# Altium schematic sheet DAC.SchDoc: Projekt DAC AUPSC 2019
size A4; Date: 4.10.2019; Author: Michał Grzegorzek; Organization: AGH; SheetNumber: 2; SheetTotal: 4; PageSetup: Record=PageOptions|CenterHorizontal=True|CenterVertical=True|PrintScale=0.52|XCorrection=1.00|YCorrection=1.00|PrintKind=1|BorderSize=5000000|LeftOffset=0|BottomOffset=0|Orientation=2|PaperLength=4200|PaperWidth=2970|Scale=100|PaperSource=7|PrintQuality=600|MediaType=1|DitherType=10|PaperKind=A3|PrintScaleMode=1
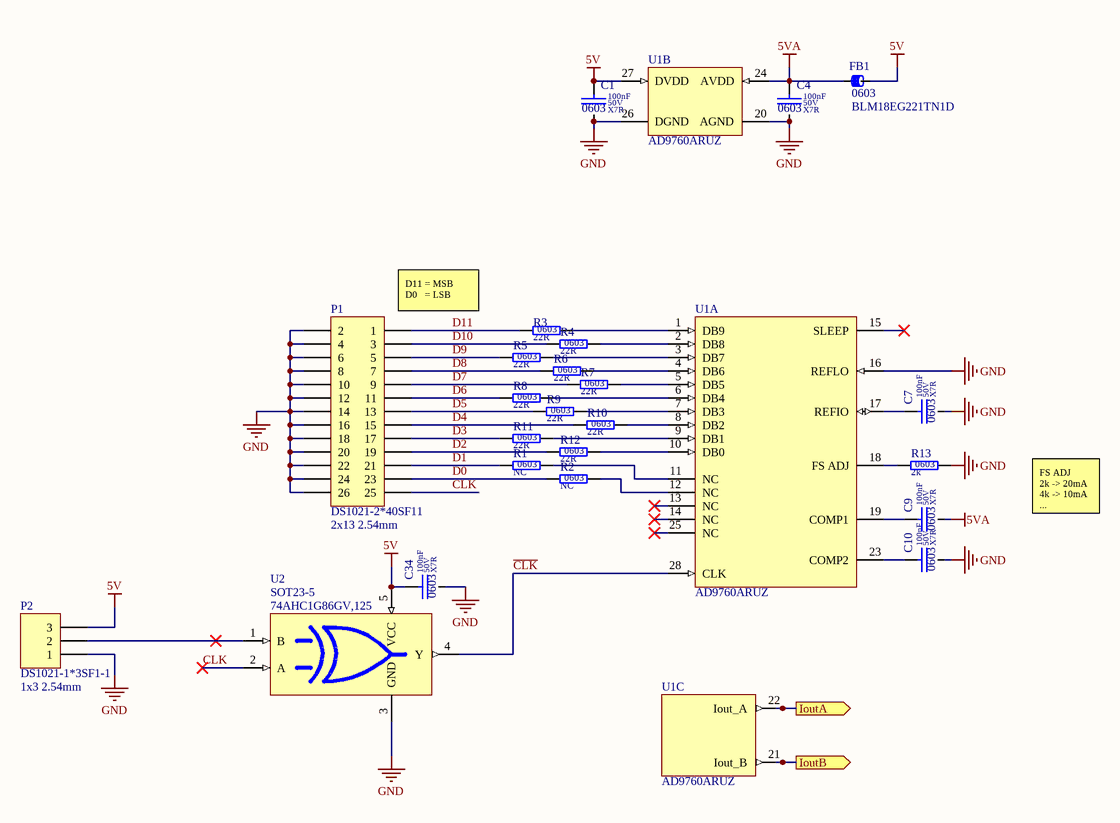
[diagram p0: DAC.SchDoc]

## Parts
C1  value 100nF  Dielectric: X7R  Voltage: 50V  SCH_Footprint: 0603  [C_0603_1608]  (hidden comment: Ceramic X7R)
C4  value 100nF  Dielectric: X7R  Voltage: 50V  SCH_Footprint: 0603  [C_0603_1608]  (hidden comment: Ceramic X7R)
C7  value 100nF  Dielectric: X7R  Voltage: 50V  SCH_Footprint: 0603  [C_0603_1608]  (hidden comment: Ceramic X7R)
C9  value 100nF  Dielectric: X7R  Voltage: 50V  SCH_Footprint: 0603  [C_0603_1608]  (hidden comment: Ceramic X7R)
C10  value 100nF  Dielectric: X7R  Voltage: 50V  SCH_Footprint: 0603  [C_0603_1608]  (hidden comment: Ceramic X7R)
C34  value 100nF  Dielectric: X7R  Voltage: 50V  SCH_Footprint: 0603  [C_0603_1608]  (hidden comment: Ceramic X7R)
FB1  value BLM18EG221TN1D  SCH_Footprint: 0603  [FB_0603_1608]  (hidden comment: Ferrite bead)
P1  value DS1021-2*40SF11  SCH_Footprint: 2x13 2.54mm  [P_HEADER_2x13_2.54]  (hidden comment: Goldpin)
P2  value DS1021-1*3SF1-1  SCH_Footprint: 1x3 2.54mm  [P_HEADER_1x3_2.54]  (hidden comment: Goldpin)
R1  value NC  SCH_Footprint: 0603  [R_NC_0603_1608]  (hidden comment: Resistor)
R2  value NC  SCH_Footprint: 0603  [R_NC_0603_1608]  (hidden comment: Resistor)
R3  value 22R  SCH_Footprint: 0603  [R_0603_1608]  (hidden comment: Resistor)
R4  value 22R  SCH_Footprint: 0603  [R_0603_1608]  (hidden comment: Resistor)
R5  value 22R  SCH_Footprint: 0603  [R_0603_1608]  (hidden comment: Resistor)
R6  value 22R  SCH_Footprint: 0603  [R_0603_1608]  (hidden comment: Resistor)
R7  value 22R  SCH_Footprint: 0603  [R_0603_1608]  (hidden comment: Resistor)
R8  value 22R  SCH_Footprint: 0603  [R_0603_1608]  (hidden comment: Resistor)
R9  value 22R  SCH_Footprint: 0603  [R_0603_1608]  (hidden comment: Resistor)
R10  value 22R  SCH_Footprint: 0603  [R_0603_1608]  (hidden comment: Resistor)
R11  value 22R  SCH_Footprint: 0603  [R_0603_1608]  (hidden comment: Resistor)
R12  value 22R  SCH_Footprint: 0603  [R_0603_1608]  (hidden comment: Resistor)
R13  value 2k  SCH_Footprint: 0603  [R_0603_1608]  (hidden comment: Resistor)
U1  value AD9760ARUZ  [TSSOP28_EP_4X10X12]  (hidden comment: 10-Bit, 125MSPS D/A Converter)  (parts A,B,C of 3)
U2  value 74AHC1G86GV,125  SCH_Footprint: SOT23-5  [SOT23-5_SC74A_SOT753_M]  (hidden comment: 2-input EXCLUSIVE-OR gate)

## Ports
IoutA (out), IoutB (out)

## Nets
5V: C1.1 C34.1 FB1.2 P2.3 U1.27(DVDD) U2.5(VCC)
5VA: C4.1 C9.2 FB1.1 U1.24(AVDD)
GND: C1.2 C4.2 C7.2 C10.2 C34.2 P1.2 P1.4 P1.6 P1.8 P1.10 P1.12 P1.14 P1.16 P1.18 P1.20 P1.22 P1.24 P1.26 P2.1 R13.2 U1.16(REFLO) U1.20(AGND) U1.26(DGND) U2.3(GND)
~{CLK}: U1.28(CLK) U2.4(Y)
CLK: P1.25 U2.2(A)
D0: P1.23 R2.1
D1: P1.21 R1.1
D2: P1.19 R12.1
D3: P1.17 R11.1
D4: P1.15 R10.1
D5: P1.13 R9.1
D6: P1.11 R8.1
D7: P1.9 R7.1
D8: P1.7 R6.1
D9: P1.5 R5.1
D10: P1.3 R4.1
D11: P1.1 R3.1
IoutA: U1.22(Iout_A) ; port IoutA
IoutB: U1.21(Iout_B) ; port IoutB
NetC7_1: C7.1 U1.17(REFIO)
NetC9_1: C9.1 U1.19(COMP1)
NetC10_1: C10.1 U1.23(COMP2)
NetP2_2: P2.2 U2.1(B)
NetR1_2: R1.2 U1.11(NC)
NetR2_2: R2.2 U1.12(NC)
NetR3_2: R3.2 U1.1(DB9)
NetR4_2: R4.2 U1.2(DB8)
NetR5_2: R5.2 U1.3(DB7)
NetR6_2: R6.2 U1.4(DB6)
NetR7_2: R7.2 U1.5(DB5)
NetR8_2: R8.2 U1.6(DB4)
NetR9_2: R9.2 U1.7(DB3)
NetR10_2: R10.2 U1.8(DB2)
NetR11_2: R11.2 U1.9(DB1)
NetR12_2: R12.2 U1.10(DB0)
NetR13_1: R13.1 U1.18(FS_ADJ)

Not connected (* = marked no-connect by the designer): U1 13(NC)* 14(NC)* 15(SLEEP)* 25(NC)*

## Notes on the sheet
- (near P1) D11 = MSB
  D0   = LSB
- FS ADJ
  2k -> 20mA
  4k -> 10mA
  ...
- Title:
- Sheet:
- of
- Author:
- Model:
- Document Number:
- Checked by:
- Iss-Rev:
- Approved by:
- Date:
- File name:

## Library data of the parts
C1 C4 C7 C9 C10 C34 = C_100nF_50V_X7R_0603_5: Capacitor; Manufacturer: Samsung; Manufacturer Part Number: CL10B104JB8NNNC; Tolerance (%): 5; Part Number: C_100nF_50V_X7R_0603_5; HelpURL: http://www.tme.eu/pl/Document/4a42202b32dab16128fe107dd69598cc/samsung-chip-cap.pdf; Supplier 1: TME; Supplier Part Number 1: CL10B104JB8NNNC; Supplier 2: RS Components; Supplier 3: Farnell; Supplier 4: Mouser; Supplier 5: Digi-Key
FB1 = FB_BLM18EG221TN1D: Manufacturer: Murata; Current: 1A; Resistance: 150mR; Part Number: FB_BLM18EG221TN1D; HelpURL: http://datasheet.octopart.com/BLM18EG221TN1D-Murata-datasheet-66919.pdf; Manufacturer Part Number: BLM18EG221TN1D; Supplier 1: TME; Supplier 2: RS Components; Supplier Part Number 2: 7926243P; Supplier 3: Farnell; Supplier Part Number 3: 1515717; Supplier 4: Mouser; Supplier Part Number 4: 81-BLM18EG221TN1D; Supplier 5: Digi-Key; Supplier Part Number 5: 490-5979-1-ND
P1 = P_HEADER_2x13_2.54: Header, 26-Pin, Dual row; Manufacturer: Connfly; Part Number: P_HEADER_2x13_2.54; Component Type: Standard; HelpURL: http://www.tme.eu/pl/details/zl202-80g/listwy-i-gniazda-kolkowe/connfly/ds1021-2_40sf11/; Manufacturer Part Number: DS1021-2*40SF11; Supplier 1: TME; Supplier Part Number 1: ZL202-80G; Supplier 2: RS Components; Supplier 3: Farnell; Supplier 4: Mouser; Supplier 5: Digi-Key
P2 = P_HEADER_1x3_2.54: Header, 3-Pin; Manufacturer: Connfly; Part Number: P_HEADER_1x3_2.54; Component Type: Standard; HelpURL: http://www.tme.eu/en/Document/cc301e58a5da78cb543a94b5a5b7f06a/DS1021.pdf; Manufacturer Part Number: DS1021-1*3SF1-1; Supplier 1: TME; Supplier Part Number 1: ZL201-03G; Supplier 2: RS Components; Supplier 3: Farnell; Supplier 4: Mouser; Supplier 5: Digi-Key
R1 R2 = R_GENERIC_0603: Part Number: R_GENERIC_0603; Supplier 1: TME; Supplier 2: RS Components; Supplier 3: Farnell; Supplier 4: Mouser; Supplier 5: Digi-Key
R3-R12 = R_22R_0603_5: Manufacturer: Walsin; Manufacturer Part Number: WF06P220JTL; Voltage: 50V; Power: 125mW; Tolerance: 5%; Part Number: R_22R_0603_5; HelpURL: http://www.tme.eu/pl/Document/b315665a56acbc42df513c99b390ad98/ROYALOHM-THICKFILM.pdf; Supplier 1: TME; Supplier Part Number 1: WF06P-22R-5%; Supplier 2: RS Components; Supplier 3: Farnell; Supplier 4: Mouser; Supplier 5: Digi-Key
R13 = R_2k_0603_1: Manufacturer: Yageo; Manufacturer Part Number: RC0603FR-072KL; Voltage: 50V; Power: 100mW; Tolerance: 1%; Part Number: R_2k_0603_1; HelpURL: http://datasheet.octopart.com/RC0603FR-072KL-Yageo-datasheet-8328172.pdf; Supplier 1: TME; Supplier Part Number 1: RC0603FR-072K; Supplier 2: RS Components; Supplier 3: Farnell; Supplier 4: Mouser; Supplier Part Number 4: 603-RC0603FR-072KL; Supplier 5: Digi-Key; Supplier Part Number 5: 311-2.00KHRCT-ND
U1 = U_AD9760ARUZ: 10-Bit 125Msps DACs; Manufacturer: Analog Devices; SCH_Footprint: TSSOP28; Part Number: U_AD9760ARUZ; HelpURL: https://www.analog.com/media/en/technical-documentation/data-sheets/AD9760.pdf; Manufacturer Part Number: AD9760ARUZ; Supplier 1: TME; Supplier 2: RS Components; Supplier 3: Farnell; Supplier Part Number 3: 2192248; Supplier 4: Mouser; Supplier Part Number 4: 584-AD9760ARUZ; Supplier 5: Digi-Key; Supplier Part Number 5: AD9760ARUZ-ND
U2 = U_74AHC1G86GV.125: Manufacturer: Nexperia; Part Number: U_74AHC1G86GV.125; HelpURL: https://assets.nexperia.cn/documents/data-sheet/74AHC_AHCT1G86_Q100.pdf; Manufacturer Part Number: 74AHC1G86GV,125; Supplier 1: TME; Supplier Part Number 1: 74AHC1G86GV.125; Supplier 2: RS Components; Supplier Part Number 2: 146-0517; Supplier 3: Farnell; Supplier Part Number 3: 2777697; Supplier 4: Mouser; Supplier Part Number 4: 771-AHC1G86GV125; Supplier 5: Digi-Key; Supplier Part Number 5: 1727-4201-2-ND